# EAGLE design sensor (EAGLE 7.1.0)
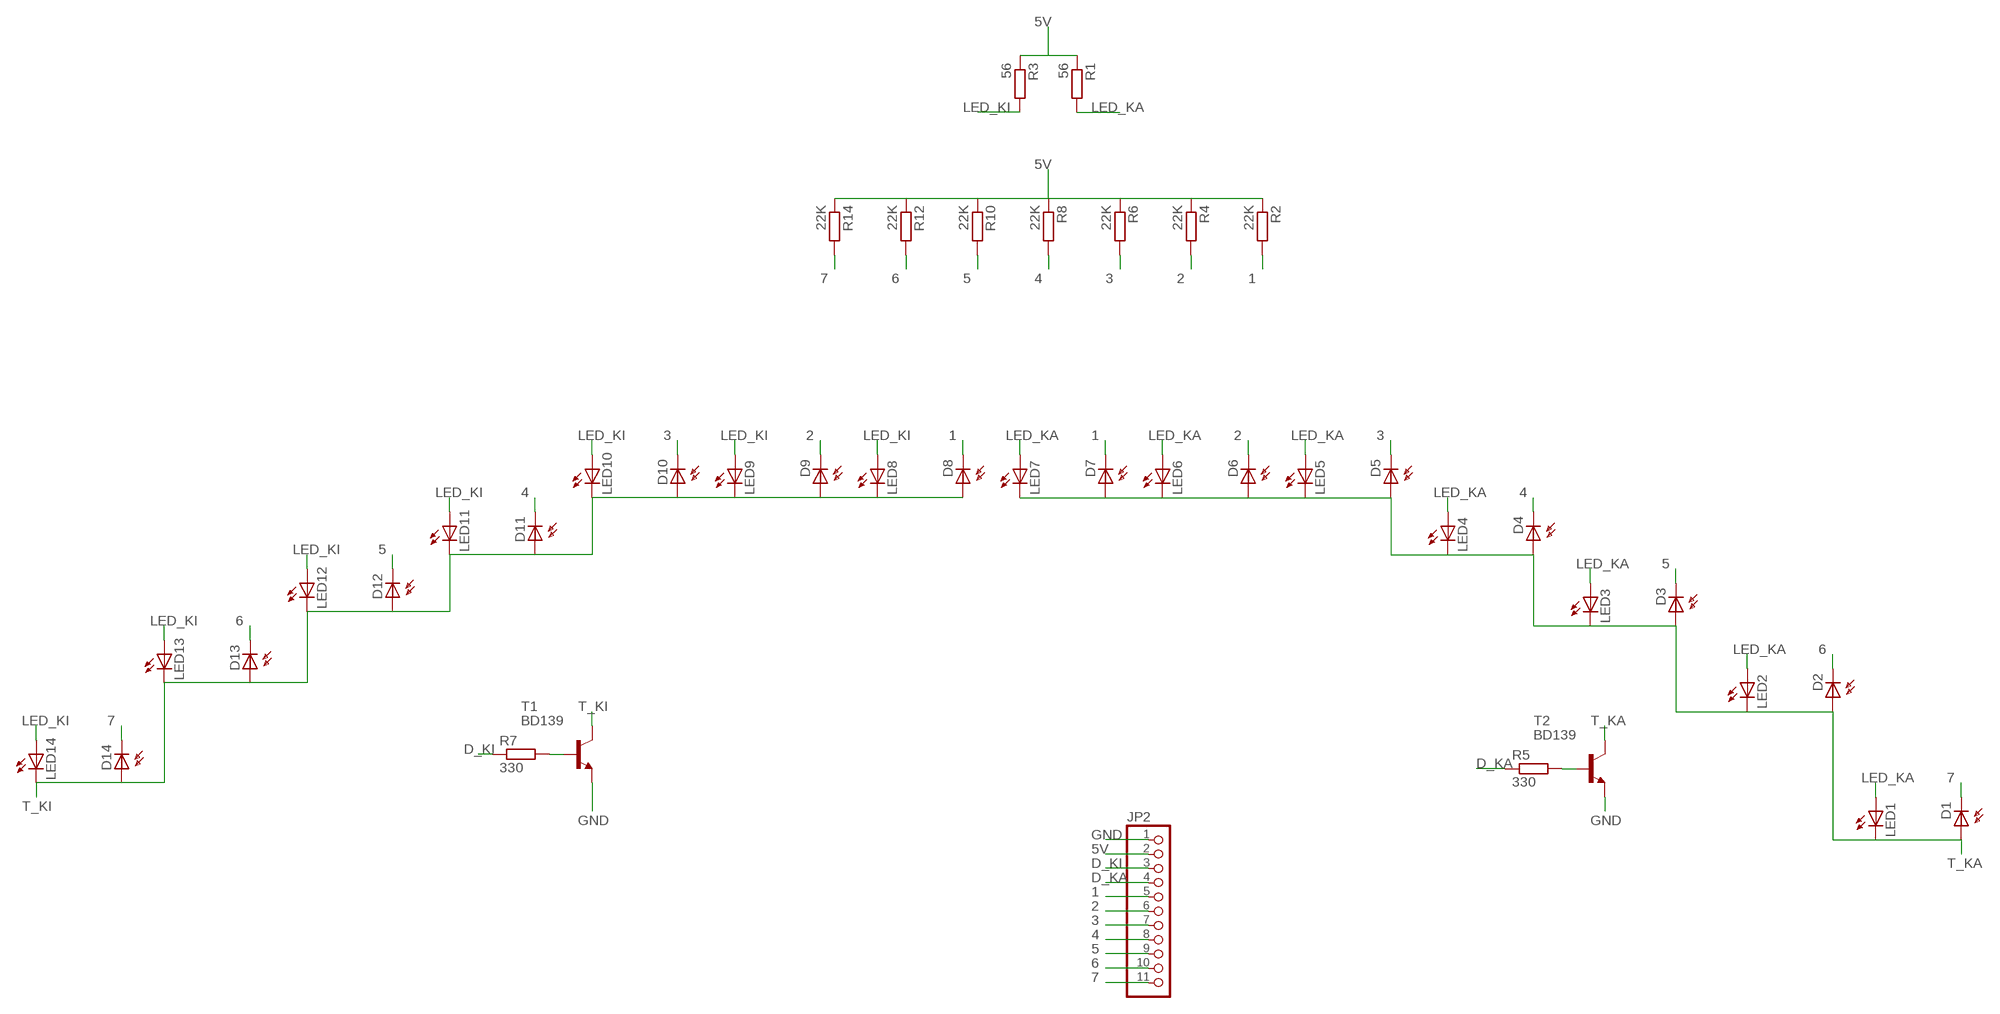
[diagram p0: schematic, sheet 1]

## Parts
D1  BPX65  [BPX65]
D2  BPX65  [BPX65]
D3  BPX65  [BPX65]
D4  BPX65  [BPX65]
D5  BPX65  [BPX65]
D6  BPX65  [BPX65]
D7  BPX65  [BPX65]
D8  BPX65  [BPX65]
D9  BPX65  [BPX65]
D10  BPX65  [BPX65]
D11  BPX65  [BPX65]
D12  BPX65  [BPX65]
D13  BPX65  [BPX65]
D14  BPX65  [BPX65]
JP2  PINHD-1X11  [1X11]
LED1  LED3MM  [LED3MM]
LED2  LED3MM  [LED3MM]
LED3  LED3MM  [LED3MM]
LED4  LED3MM  [LED3MM]
LED5  LED3MM  [LED3MM]
LED6  LED3MM  [LED3MM]
LED7  LED3MM  [LED3MM]
LED8  LED3MM  [LED3MM]
LED9  LED3MM  [LED3MM]
LED10  LED3MM  [LED3MM]
LED11  LED3MM  [LED3MM]
LED12  LED3MM  [LED3MM]
LED13  LED3MM  [LED3MM]
LED14  LED3MM  [LED3MM]
R1  56  R-EU_0207/7  [0207/7]
R2  22K  R-EU_0207/7  [0207/7]
R3  56  R-EU_0207/7  [0207/7]
R4  22K  R-EU_0207/7  [0207/7]
R5  330  R-EU_0207/7  [0207/7]
R6  22K  R-EU_0207/7  [0207/7]
R7  330  R-EU_0207/7  [0207/7]
R8  22K  R-EU_0207/7  [0207/7]
R10  22K  R-EU_0207/7  [0207/7]
R12  22K  R-EU_0207/7  [0207/7]
R14  22K  R-EU_0207/7  [0207/7]
T1  BD139  [TO126]
T2  BD139  [TO126]

## Nets
1: D7.K(C) D8.K(C) JP2.5 R2.2
2: D6.K(C) D9.K(C) JP2.6 R4.2
3: D5.K(C) D10.K(C) JP2.7 R6.2
4: D4.K(C) D11.K(C) JP2.8 R8.2
5: D3.K(C) D12.K(C) JP2.9 R10.2
5V: JP2.2 R1.1 R2.1 R3.1 R4.1 R6.1 R8.1 R10.1 R12.1 R14.1
6: D2.K(C) D13.K(C) JP2.10 R12.2
7: D1.K(C) D14.K(C) JP2.11 R14.2
D_KA: JP2.4 R5.1
D_KI: JP2.3 R7.1
GND: JP2.1 T1.1(E) T2.1(E)
LED_KA: LED1.A LED2.A LED3.A LED4.A LED5.A LED6.A LED7.A R1.2
LED_KI: LED8.A LED9.A LED10.A LED11.A LED12.A LED13.A LED14.A R3.2
N$1: R7.2 T1.3(B)
N$2: R5.2 T2.3(B)
T_KA: D1.A D2.A D3.A D4.A D5.A D6.A D7.A LED1.K(C) LED2.K(C) LED3.K(C) LED4.K(C) LED5.K(C) LED6.K(C) LED7.K(C) T2.2(C)
T_KI: D8.A D9.A D10.A D11.A D12.A D13.A D14.A LED8.K(C) LED9.K(C) LED10.K(C) LED11.K(C) LED12.K(C) LED13.K(C) LED14.K(C) T1.2(C)

## Library data of the parts
D1-D14 = opto-trans-siemens:BPX65: PHOTO DIODE; MPN: BPX65.; OC_FARNELL: 327451; OC_NEWARK: 06WX2764
JP2 = pinhead:PINHD-1X11: PIN HEADER
LED1-LED14 = led:LED: LED OSRAM: - CHIPLED LG R971, LG N971, LY N971, LG Q971, LY Q971, LO R971, LY R971 LH N974, LH R974 LS Q976, LO Q976, LY Q976 LO Q996 - Hyper CHIPLED LW Q18S LB Q993, LB Q99A, LB R99A - SideLED LS A670, LO A670, LY A670, LG A670, LP A670 LB A673, LV A673, LT A673, LW A673 LH A674 LY A675 LS A676, LA A676, LO A676, LY A676, LW A676 LS A679, LY A679, LG A679 - Hyper Micro SIDELED® LS Y876, LA Y876, LO Y876, LY Y876 LT Y87S - SmartLED LW L88C, LW L88S LB L89C, LB L89S, LG L890 LS L89K, LO L89K, LY L89K LS L896, LA L896, LO L896, LY L896 - TOPLED LS T670, LO T670, LY T670, LG T670, LP T670 LSG T670, LSP T670, LSY T670, LOP T670, LYG T670 LG T671, LOG T671, LSG T671 LB T673, LV T673, LT T673, LW T673 LH T674 LS T676, LA T676, LO T676, LY T676, LB T676, LH T676, LSB T676, LW T676 LB T67C, LV T67C, LT T67C, LS T67K, LO T67K, LY T67K, LW E67C LS E67B, LA E67B, LO E67B, LY E67B, LB E67C, LV E67C, LT E67C LW T67C LS T679, LY T679, LG T679 LS T770, LO T770, LY T770, LG T770, LP T770 LB T773, LV T773, LT T773, LW T773 LH T774 LS E675, LA E675, LY E675, LS T675 LS T776, LA T776, LO T776, LY T776, LB T776 LHGB T686 LT T68C, LB T68C - Hyper Mini TOPLED® LB M676 - Mini TOPLED Santana® LG M470 LS M47K, LO M47K, LY M47K Source: http://www.osram.convergy.de LUXEON: - LUMILED® LXK2-PW12-R00, LXK2-PW12-S00, LXK2-PW14-U00, LXK2-PW14-V00 LXK2-PM12-R00, LXK2-PM12-S00, LXK2-PM14-U00 LXK2-PE12-Q00, LXK2-PE12-R00, LXK2-PE12-S00, LXK2-PE14-T00, LXK2-PE14-U00 LXK2-PB12-K00, LXK2-PB12-L00, LXK2-PB12-M00, LXK2-PB14-N00, LXK2-PB14-P00, LXK2-PB14-Q00 LXK2-PR12-L00, LXK2-PR12-M00, LXK2-PR14-Q00, LXK2-PR14-R00 LXK2-PD12-Q00, LXK2-PD12-R00, LXK2-PD12-S00 LXK2-PH12-R00, LXK2-PH12-S00 LXK2-PL12-P00, LXK2-PL12-Q00, LXK2-PL12-R00 Source: www.luxeon.com KINGBRIGHT: KA-3528ASYC Source: www.kingbright.com
R1-R8 R10 R12 R14 = rcl:R-EU_: RESISTOR, European symbol
T1 T2 = transistor:BD139: NPN TRANSISTOR

## Board
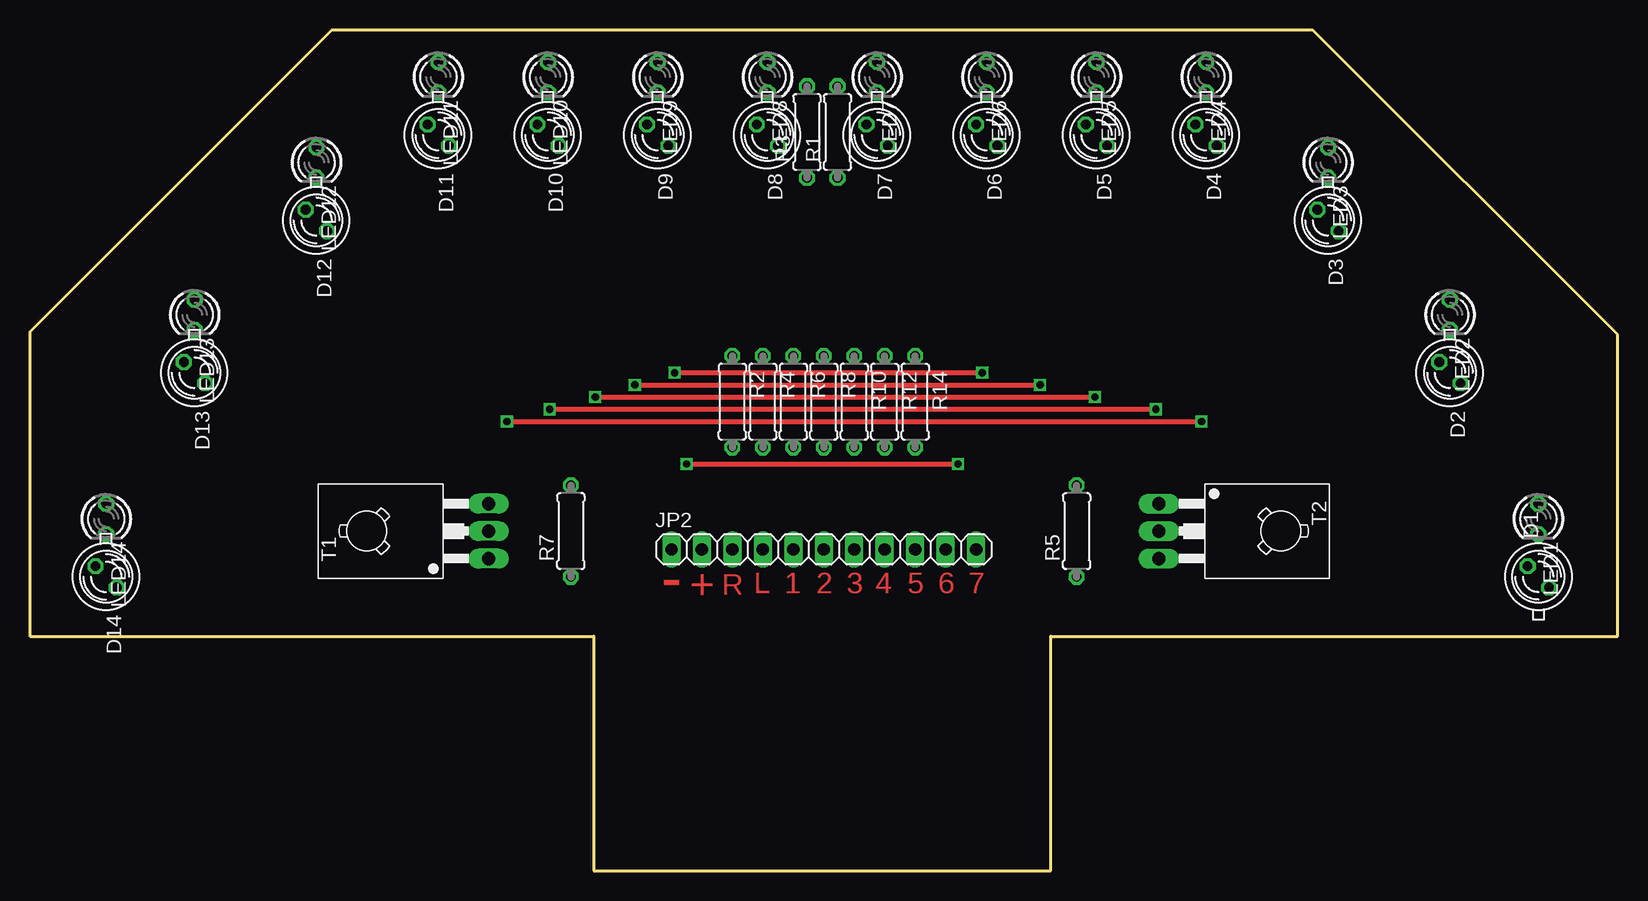
[diagram p1: board, top side]
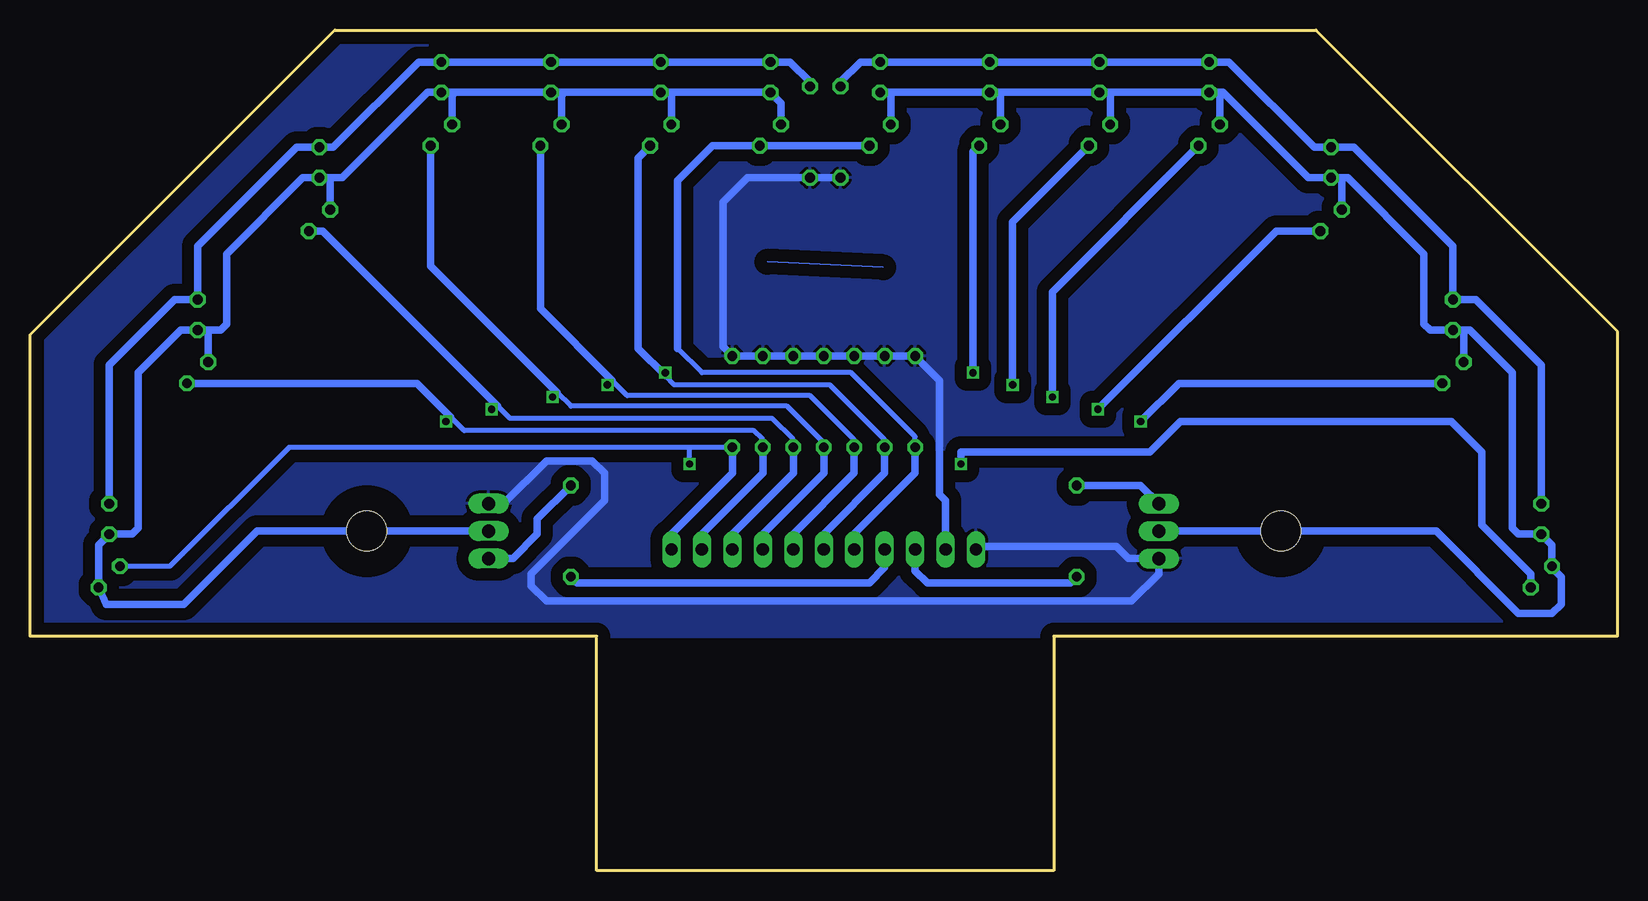
[diagram p2: board, bottom side, seen from below]

Size 132.33 x 70.1 mm. Coordinates in mm from the lower left corner, seen from the top.
Outline: 0,19.56 46.99,19.56 46.99,0 85.09,0 85.09,19.56 132.33,19.56 132.33,44.7 106.93,70.1 25.15,70.1 0,44.96 0,19.56
Copper layers (1*16): Top 0.035mm / dielectric 1.5mm / Bottom 0.035mm
Design rules "default *": minimum track width 10mil, minimum drill 24mil, track to track 40mil, track to pad 40mil, pad to pad 8mil, via to via 8mil, smd to smd 8mil, copper to edge 40mil, drill to drill 8mil, minimum pad ring 10mil, minimum via ring 8mil, stop-mask expansion 4mil, vias tented up to drill 0mil, thermal gap 10mil

### Footprints (pad centres in the part's own frame; a part is rotated, then mirrored left to right if it is on the bottom)
BPX65 = drill 0.813 octagon: A -0.889,-0.889; K 0.889,0.889
1X11 = drill 1.016 long: 1 -12.7,0; 2 -10.16,0; 3 -7.62,0; 4 -5.08,0; 5 -2.54,0; 6 0,0; 7 2.54,0; 8 5.08,0; 9 7.62,0; 10 10.16,0; 11 12.7,0
LED3MM = drill 0.813 octagon: A -1.27,0; K 1.27,0
0207/7 = drill 0.813 octagon: 1 -3.81,0; 2 3.81,0
TO126 = drill 1.118 long: 1 -2.286,-5.08; 2 0,-5.08; 3 2.286,-5.08 | hole 3.302: 0,5.08

### Placement (x,y rotation side)
D1  125.73,24.51 90 top
D2  118.36,41.53 270 top
D3  108.2,54.23 270 top
D4  98.04,61.34 270 top
D5  88.9,61.34 270 top
D6  79.76,61.34 270 top
D7  70.61,61.34 270 top
D8  61.47,61.34 270 top
D9  52.32,61.34 270 top
D10  43.18,61.34 270 top
D11  34.04,61.34 270 top
D12  23.88,54.23 270 top
D13  13.72,41.53 270 top
D14  6.35,24.51 270 top
JP2  66.17,26.8 0 top
LED1  125.73,29.34 270 top
LED2  118.36,46.36 270 top
LED3  108.2,59.06 270 top
LED4  98.04,66.17 270 top
LED5  88.9,66.17 270 top
LED6  79.76,66.17 270 top
LED7  70.61,66.17 270 top
LED8  61.47,66.17 270 top
LED9  52.32,66.17 270 top
LED10  43.18,66.17 270 top
LED11  34.04,66.17 270 top
LED12  23.88,59.06 270 top
LED13  13.72,46.36 270 top
LED14  6.35,29.34 270 top
R1  67.31,61.59 90 top
R2  58.55,39.12 270 top
R3  64.77,61.59 90 top
R4  61.09,39.12 270 top
R5  87.25,28.32 90 top
R6  63.63,39.12 270 top
R7  45.09,28.32 90 top
R8  66.17,39.12 270 top
R10  68.71,39.12 270 top
R12  71.25,39.12 270 top
R14  73.79,39.12 270 top
T1  33.15,28.32 90 top
T2  99.19,28.32 270 top

### Tracks (layer width: path | path; a pad name or v marks a point on that pad's centre or on a via)
1
  Bottom 0.406: R2.2 58.55,36.19 63.88,41.53 76.33,41.53 78.36,43.56
  Bottom 0.61: R2.2 58.55,33.15 63.63,28.07 JP2.5 | D8.K D7.K 75.44,60.45 78.36,57.53 78.36,43.56
2  (via drill 0.6)
  Top 0.406: v53.72,41.53 v79.38,41.53
  Bottom 0.406: R4.2 61.09,35.94 65.66,40.51 78.61,40.51 79.38,41.28 v79.38,41.53
  Bottom 0.61: R4.2 61.09,33.15 66.17,28.07 JP2.6 | v53.72,41.53 53.72,59.94 D9.K | 79.38,41.28 81.66,43.56 81.66,59.44 D6.K
3  (via drill 0.6)
  Top 0.406: v50.42,40.51 v84.2,40.51
  Bottom 0.406: R6.2 63.63,35.94 67.31,39.62 82.55,39.62 83.82,40.89 v84.2,40.51
  Bottom 0.61: R6.2 63.63,33.15 68.71,28.07 JP2.7 | v50.42,40.51 50.42,54.1 D10.K | D5.K 89.79,46.86 83.82,40.89
4  (via drill 0.6)
  Top 0.406: v47.12,39.5 v88.77,39.5
  Bottom 0.406: R8.2 66.17,35.69 69.22,38.73 87.25,38.73 88.39,39.88 v88.77,39.5
  Bottom 0.61: R8.2 66.17,33.15 71.25,28.07 JP2.8 | v47.12,39.5 47.12,48.26 D11.K | D4.K 98.93,50.42 88.39,39.88
5  (via drill 0.6)
  Top 0.406: v43.31,38.48 v93.85,38.48
  Bottom 0.406: R10.2 68.71,35.94 70.48,37.72 92.33,37.72 93.34,38.73 93.6,38.48 v93.85,38.48
  Bottom 0.61: R10.2 68.71,33.15 73.79,28.07 JP2.9 | v43.31,38.48 28.45,53.34 D12.K | D3.K 107.95,53.34 93.34,38.73
5V
  Bottom 0.61: R3.1 R1.1 72.52,57.78 74.55,55.75 74.55,43.69 R14.1 R12.1 R10.1 R8.1 R6.1 R4.1 R2.1 56.52,40.89 56.52,31.37 56.01,30.86 JP2.2
  pour Bottom: 25.15,70.1 106.93,70.1 132.33,44.7 132.33,35.81 132.33,35.18 0,35.18 0,44.96
6  (via drill 0.6)
  Top 0.406: v39.75,37.47 v97.66,37.47
  Bottom 0.406: R12.2 71.25,35.94 72.01,36.7 96.14,36.7 97.28,37.85 v97.66,37.47
  Bottom 0.61: R12.2 71.25,33.15 76.33,28.07 JP2.10 | v39.75,37.47 36.58,40.64 D13.K | D2.K 100.08,40.64 97.28,37.85
7  (via drill 0.6)
  Top 0.406: v54.74,33.91 v77.34,33.91
  Bottom 0.406: R14.2 77.34,35.31 | 77.34,35.31 110.74,35.31 120.65,25.4 D1.K | v77.34,33.91 77.34,35.31
  Bottom 0.61: R14.2 73.79,33.15 78.87,28.07 JP2.11 | D14.K 7.24,24.76 11.3,28.83 11.3,34.92 13.84,37.47 36.45,37.47 38.99,34.92 54.74,34.92 v54.74,33.91
D_KA
  Bottom 0.61: JP2.4 61.09,25.27 62.36,24 86.74,24 R5.1
D_KI
  Bottom 0.61: JP2.3 58.55,25.02 57.53,24 45.59,24 R7.1
GND
  Bottom 0.61: JP2.1 53.21,27.05 41.78,27.05 40.77,26.04 T1.1 38.23,24.76 40.51,22.48 89.28,22.48 90.55,23.75 90.55,24.76 84.45,30.86 84.45,33.15 85.47,34.16 89.28,34.16 92.84,30.61 T2.1
  pour Bottom: 25.15,70.1 106.93,70.1 132.33,44.7 132.33,19.56 0,19.56 0,44.96
LED_KA
  Bottom 0.61: R1.2 67.31,65.79 68.96,67.44 LED7.A LED6.A LED5.A LED4.A 99.95,67.44 107.06,60.33 LED3.A 110.11,60.33 118.36,52.07 LED2.A 120.27,47.62 125.73,42.16 LED1.A
LED_KI
  Bottom 0.61: R3.2 64.77,65.79 63.12,67.44 LED8.A LED9.A LED10.A LED11.A 32.39,67.44 25.27,60.33 LED12.A 21.97,60.33 13.72,52.07 LED13.A 11.81,47.62 6.35,42.16 LED14.A
N$1
  Bottom 0.61: R7.2 39.75,32.13 T1.3
N$2
  Bottom 0.61: T2.3 92.08,26.04 90.04,28.07 90.04,29.34 R5.2
T_KA
  Bottom 0.61: D7.A 69.72,64.01 LED7.K 78.87,64.9 | 78.87,64.9 LED6.K 87.76,64.9 | 87.76,64.9 LED5.K 96.9,64.9 | 96.9,64.9 LED4.K 99.19,64.9 106.3,57.78 107.32,57.78 | 107.32,57.78 LED3.K 109.6,57.78 115.95,51.44 115.95,45.59 116.46,45.08 117.73,45.08 | 117.73,45.08 LED2.K 119.76,45.08 123.32,41.53 123.32,28.57 123.83,28.07 LED1.K 126.62,27.18 D1.A 125.98,22.22 119.51,22.22 113.41,28.32 T2.2 | D6.A 78.87,64.9 | D5.A 88.01,64.64 87.76,64.9 | D4.A 97.16,64.64 96.9,64.9 | D3.A 107.32,57.78 | D2.A 117.48,44.83 117.73,45.08
T_KI
  Bottom 0.61: LED8.K 60.58,64.9 | 60.58,64.9 LED9.K 51.44,64.9 | 51.44,64.9 LED10.K 42.29,64.9 | 42.29,64.9 LED11.K 33.15,64.9 | 33.15,64.9 32.89,64.9 25.78,57.78 LED12.K 23.24,57.78 | 23.24,57.78 22.48,57.78 16.13,51.44 16.13,45.59 15.62,45.08 LED13.K 12.83,45.08 | 12.83,45.08 12.32,45.08 8.76,41.53 8.76,28.57 8.26,28.07 LED14.K 5.46,27.18 D14.A 5.46,25.27 4.7,24.51 4.7,22.22 5.46,21.46 8.26,21.46 15.11,28.32 T1.2 | D13.A 12.83,45.08 | D12.A 22.99,57.53 23.24,57.78 | D11.A 33.15,64.9 | D10.A 42.29,64.9 | D9.A 51.44,64.9 | D8.A 60.58,64.9
(copper drawn outside any net)
  shapes: Bottom area x1

### Text on the board
Top: R | L | 1 | 2 | 3 | 4 | 5 | 6 | 7 | - | +